# EAGLE design Motherboard_Single (EAGLE 9.6.2)
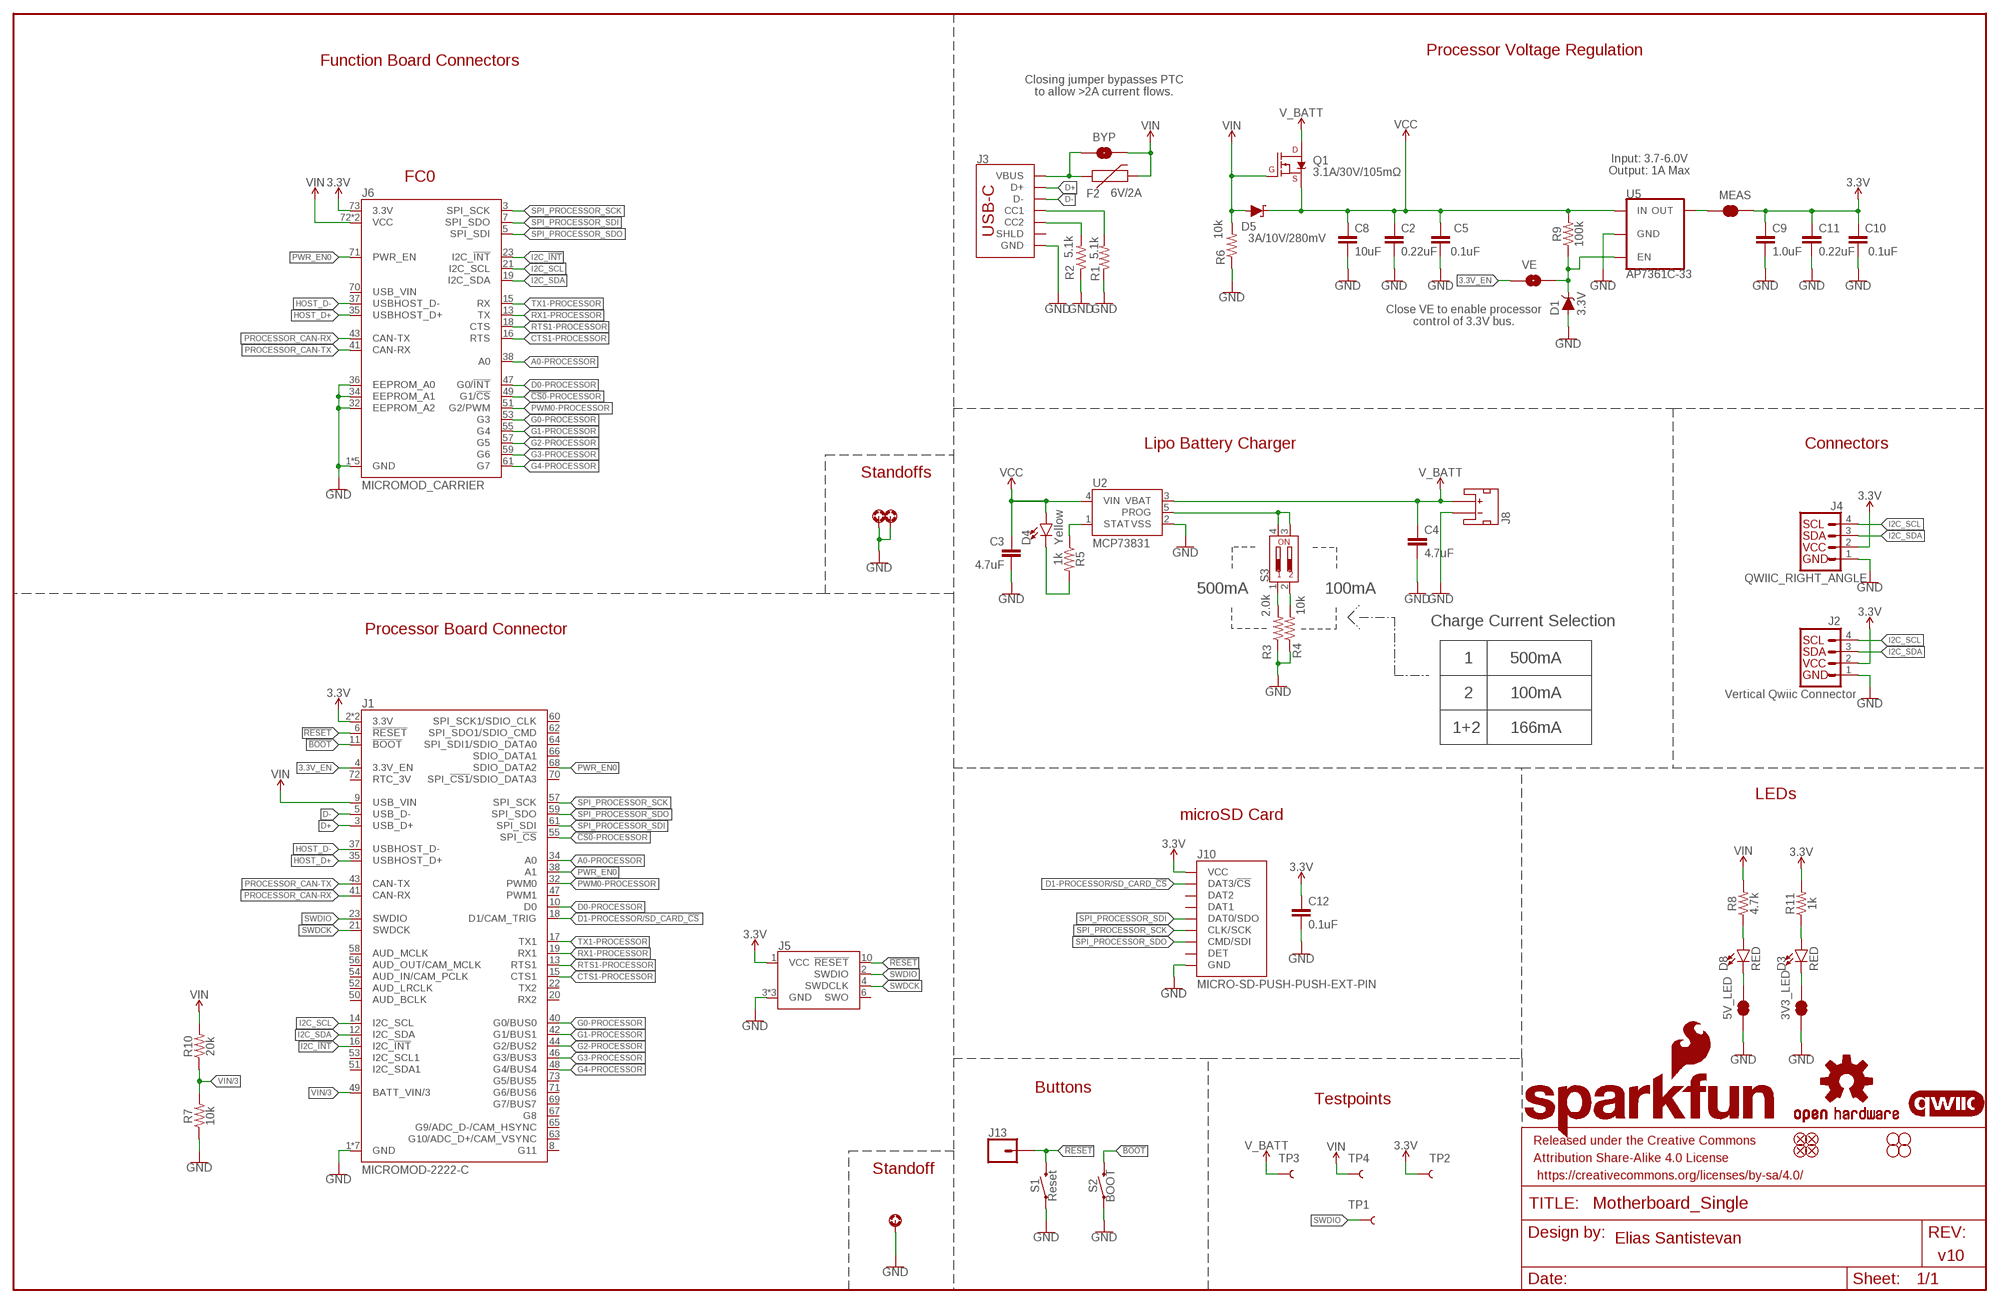
[diagram p0: schematic, sheet 1]

## Parts
3V3_LED  JUMPER-SMT_2_NC_TRACE_SILK  [SMT-JUMPER_2_NC_TRACE_SILK]
5V_LED  JUMPER-SMT_2_NC_TRACE_SILK  [SMT-JUMPER_2_NC_TRACE_SILK]
BYP  JUMPER-SMT_2_NO_SILK  [SMT-JUMPER_2_NO_SILK]
C2  0.22uF  0.22UF-0603-25V-10%  [0603]
C3  4.7uF  4.7UF-0603-6.3V-(10%)  [0603]
C4  4.7uF  4.7UF-0603-35V-(20%)  [0603]
C5  0.1uF  0.1UF-0603-25V-(+80/-20%)  [0603]
C8  10uF  10UF-0805-10V-10%  [0805]
C9  1.0uF  1.0UF-0603-16V-10%  [0603]
C10  0.1uF  0.1UF-0603-25V-(+80/-20%)  [0603]
C11  0.22uF  0.22UF-0603-25V-10%  [0603]
C12  0.1uF  0.1UF-0603-25V-(+80/-20%)  [0603]
D1  3.3V  DIODE-ZENER-MM3Z3V3T1G  [SOD-323]
D3  RED  LED-RED0603  [LED-0603]
D4  Yellow  LED-YELLOW0603  [LED-0603]
D5  3A/10V/280mV  DIODE-SCHOTTKY-BAT60A  [SOD-323]
D8  RED  LED-RED0603  [LED-0603]
F2  6V/2A  PPTC_6V2A  [1210]
FD1  FIDUCIAL1X2  [FIDUCIAL-1X2]
FD2  FIDUCIAL1X2  [FIDUCIAL-1X2]
FD3  FIDUCIAL1X2  [FIDUCIAL-1X2]
FD4  FIDUCIAL1X2  [FIDUCIAL-1X2]
FRAME1  FRAME-LEDGER  [CREATIVE_COMMONS]
H3  STAND-OFF-REFLOW-M2.5_2.5MM_TALL  [STAND-OFF-REFLOW-M2.5]
H4  STAND-OFF-REFLOW-M2.5_2.5MM_TALL  [STAND-OFF-REFLOW-M2.5]
H8  STAND-OFF-REFLOW-M2.5_2.5MM_TALL  [STAND-OFF-REFLOW-M2.5]
H14  STAND-OFFTIGHT  [STAND-OFF-TIGHT]
H15  STAND-OFFTIGHT  [STAND-OFF-TIGHT]
H16  STAND-OFFTIGHT  [STAND-OFF-TIGHT]
H17  STAND-OFFTIGHT  [STAND-OFF-TIGHT]
J1  MICROMOD-2222-C  [M.2-CONNECTOR-E]
J2  Vertical Qwiic Connector  QWIIC_CONNECTOR  [JST04_1MM_VERT]
J3  USB_C_2-LAYER_PADS  [USB-C-16P-2LAYER-PADS]
J4  QWIIC_RIGHT_ANGLE  QWIIC_CONNECTORJS-1MM  [JST04_1MM_RA]
J5  CORTEX_JTAG_DEBUG_MINIMUM_PTH  [2X5-PTH-1.27MM]
J6  MICROMOD_CARRIER  [M.2-CONNECTOR-E-FUNCTION-STANDARD]
J8  JST_2MM_MALE  [JST-2-SMD]
J10  MICRO-SD-PUSH-PUSH-EXT-PIN  [MICROSD-EXTERNALPIN]
J13  CONN_01PTH_NO_SILK_YES_STOP  [1X01_NO_SILK]
LOGO1  QWIIC_LOGO_8MM  [QWIIC_8MM]
LOGO2  SFE_LOGO_NAME_FLAME.3_INCH  [SFE_LOGO_NAME_FLAME_.3]
LOGO3  OSHW-LOGOL  [OSHW-LOGO-L]
MEAS  JUMPER-COMBO_2_NC_TRACE  [COMBO-JUMPER_2_NC_TRACE]
Q1  3.1A/30V/105mΩ  MOSFET_PCH-DMG2307L  [SOT23-3]
R1  5.1k  5.1KOHM5.1KOHM-0603-1/10W-1%  [0603]
R2  5.1k  5.1KOHM5.1KOHM-0603-1/10W-1%  [0603]
R3  2.0k  2.0KOHM-0603-1/10W-5%  [0603]
R4  10k  10KOHM-0603-1/10W-1%  [0603]
R5  1k  1KOHM-0603-1/10W-1%  [0603]
R6  10k  10KOHM-0603-1/10W-1%  [0603]
R7  10k  10KOHM-0603-1/10W-1%  [0603]
R8  4.7k  4.7KOHM-0603-1/10W-1%  [0603]
R9  100k  100KOHM-0603-1/10W-1%  [0603]
R10  20k  20KOHM-0603-1/10W-1%  [0603]
R11  1k  1KOHM-0603-1/10W-1%  [0603]
S1  Reset  MOMENTARY-SWITCH-SPST-SMD-5.2-TALL-REDUNDANT  [TACTILE_SWITCH_SMD_5.2MM]
S2  BOOT  MOMENTARY-SWITCH-SPST-SMD-5.2-TALL-REDUNDANT  [TACTILE_SWITCH_SMD_5.2MM]
S3  DIP-02-SMD-50MIL  [DIPSWITCH-02-50MIL]
TP1  TEST-POINT3X5  [PAD.03X.05]
TP2  TEST-POINT3X5  [PAD.03X.05]
TP3  TEST-POINT3X5  [PAD.03X.05]
TP4  TEST-POINT3X5  [PAD.03X.05]
U2  MCP73831  [SOT23-5]
U5  AP7361C-33  AP7361C-33FGEUDFN-8  [UDFN-8]
VE  JUMPER-SMT_2_NO_SILK  [SMT-JUMPER_2_NO_SILK]

## Nets
3.3V [POWER]: C9.1 C10.1 C11.1 C12.1 J1.2(3.3V) J1.74(3.3V) J2.2 J4.2 J5.1(VCC) J6.73(3.3V) J10.4(VCC) MEAS.2 MEAS.4 R11.2 TP2.1
3.3V_EN: J1.4(3.3V_EN) VE.1
3.3V_EN_VE: D1.C R9.1 U5.5(EN) VE.2
!BOOT!: J1.11(!BOOT!) S2.3 S2.4
!CS0!-PROCESSOR: J1.55(SPI_!CS!) J6.49(G1/!CS!)
!RESET!: J1.6(!RESET!) J5.10(!RESET) J13.1 S1.3 S1.4
A0-PROCESSOR: J1.34(A0) J6.38(A0)
CTS1-PROCESSOR: J1.15(CTS1) J6.16(RTS)
D0-PROCESSOR: J1.10(D0) J6.47(G0/!INT!)
D1-PROCESSOR/SD_CARD_!CS!: J1.18(D1/CAM_TRIG) J10.2(DAT3/!CS!)
D+ [Diff pairs]: J1.3(USB_D+) J3.A6(D+) J3.B6(D+)
D- [Diff pairs]: J1.5(USB_D-) J3.A7(D-) J3.B7(D-)
G0-PROCESSOR: J1.40(G0/BUS0) J6.53(G3)
G1-PROCESSOR: J1.42(G1/BUS1) J6.55(G4)
G2-PROCESSOR: J1.44(G2/BUS2) J6.57(G5)
G3-PROCESSOR: J1.46(G3/BUS3) J6.59(G6)
G4-PROCESSOR: J1.48(G4/BUS4) J6.61(G7)
GND: 3V3_LED.1 5V_LED.1 C2.2 C3.2 C4.2 C5.2 C8.2 C9.2 C10.2 C11.2 C12.2 D1.A H3.1 H4.1 H8.1 J1.1(GND) J1.7(GND) J1.33(GND) J1.36(GND) J1.39(GND) J1.45(GND) J1.75(GND) J2.1 J3.GND J3.GND2(GND) J4.1 J5.3(GND) J5.5(GND) J5.9(GND) J6.1(GND) J6.32(EEPROM_A2) J6.33(GND) J6.34(EEPROM_A1) J6.36(EEPROM_A0) J6.39(GND) J6.45(GND) J6.75(GND) J8.1(-) J10.6(GND) J10.10(GND) J10.11(GND) J10.12(GND) J10.13(GND) R1.1 R2.1 R3.1 R4.1 R6.1 R7.1 S1.1 S1.2 S2.1 S2.2 U2.2(VSS) U5.4(GND) U5.EP(GND)
HOST_D+ [Diff pairs]: J1.35(USBHOST_D+) J6.35(USBHOST_D+)
HOST_D- [Diff pairs]: J1.37(USBHOST_D-) J6.37(USBHOST_D-)
I2C_!INT!: J1.16(I2C_!INT!) J6.23(I2C_!INT!)
I2C_SCL: J1.14(I2C_SCL) J2.4 J4.4 J6.21(I2C_SCL)
I2C_SDA: J1.12(I2C_SDA) J2.3 J4.3 J6.19(I2C_SDA)
N$2: MEAS.1 MEAS.3 U5.1(OUT)
N$3: D3.A R11.1
N$4: J3.B5(CC2) R2.2
N$5: J3.A5(CC1) R1.2
N$6 [POWER]: BYP.1 F2.1 J3.VBUS1(VBUS) J3.VBUS2(VBUS)
N$7: R3.2 S3.1
N$8: S3.3 S3.4 U2.5(PROG)
N$9: 5V_LED.2 D8.C
N$10: 3V3_LED.2 D3.C
N$11: R4.2 S3.2
N$12: D8.A R8.1
N$14: D4.C R5.2
N$15: R5.1 U2.1(STAT)
PROCESSOR_CAN-RX: J1.41(CAN-RX) J6.43(CAN-TX)
PROCESSOR_CAN-TX: J1.43(CAN-TX) J6.41(CAN-RX)
PWM0-PROCESSOR: J1.32(PWM0) J6.51(G2/PWM)
PWR_EN0: J1.38(A1) J1.68(SDIO_DATA2) J6.71(PWR_EN)
RTS1-PROCESSOR: J1.13(RTS1) J6.18(CTS)
RX1-PROCESSOR: J1.19(RX1) J6.13(TX)
SPI_PROCESSOR_SCK: J1.57(SPI_SCK) J6.3(SPI_SCK) J10.5(CLK/SCK)
SPI_PROCESSOR_SDI: J1.61(SPI_SDI) J6.7(SPI_SDO) J10.7(DAT0/SDO)
SPI_PROCESSOR_SDO: J1.59(SPI_SDO) J6.5(SPI_SDI) J10.3(CMD/SDI)
SWDCK: J1.21(SWDCK) J5.4(SWDCLK)
SWDIO: J1.23(SWDIO) J5.2(SWDIO) TP1.1
TX1-PROCESSOR: J1.17(TX1) J6.15(RX)
V_BATT [POWER]: C4.1 J8.2(+) Q1.3(D) TP3.1 U2.3(VBAT)
VCC: C2.1 C3.1 C5.1 C8.1 D4.A D5.C Q1.2(S) R9.2 U2.4(VIN) U5.8(IN)
VIN: BYP.2 D5.A F2.2 J1.9(USB_VIN) J6.72(VCC) J6.74(VCC) Q1.1(G) R6.2 R8.2 R10.2 TP4.1
VIN/3: J1.49(BATT_VIN/3) R7.2 R10.1
Unconnected: J1.8(G11) J1.20(RX2) J1.22(TX2) J1.47(PWM1) J1.50(AUD_BCLK) J1.51(I2C_SDA1) J1.52(AUD_LRCLK) J1.53(I2C_SCL1) J1.54(AUD_IN/CAM_PCLK) J1.56(AUD_OUT/CAM_MCLK) J1.58(AUD_MCLK) J1.60(SPI_SCK1/SDIO_CLK) J1.62(SPI_SDO1/SDIO_CMD) J1.63(G10/ADC_D+/CAM_VSYNC) J1.64(SPI_SDI1/SDIO_DATA0) J1.65(G9/ADC_D-/CAM_HSYNC) J1.66(SDIO_DATA1) J1.67(G8) J1.69(G7/BUS7) J1.70(SPI_!CS1!/SDIO_DATA3) J1.71(G6/BUS6) J1.72(RTC_3V) J1.73(G5/BUS5) J3.SHLD1(SHLD) J3.SHLD2(SHLD) J3.SHLD3(SHLD) J3.SHLD4(SHLD) J5.6(SWO) J6.70(USB_VIN) J8.NC1(PAD1) J8.NC2(PAD2) J10.1(DAT2) J10.8(DAT1) J10.9(DET)

## Notes on the sheet
- Processor Voltage Regulation
- Function Board Connectors
- Closing jumper bypasses PTC
  to allow >2A current flows.
- Input: 3.7-6.0V
  Output: 1A Max
- FC0
- Close VE to enable processor
  control of 3.3V bus.
- Lipo Battery Charger | Connectors
- Standoffs
- 500mA | 100mA
- Charge Current Selection
- Processor Board Connector
- 1 | 500mA
- 2 | 100mA
- 1+2 | 166mA
- LEDs
- microSD Card
- Buttons
- Testpoints
- Standoff
- Elias Santistevan
- v10

## Library data of the parts
3V3_LED 5V_LED = SparkFun-Jumpers:JUMPER-SMT_2_NC_TRACE: Normally closed trace jumper This jumper has a trace between two pads so it's normally closed (NC). Use a razor knife to open the connection. For best results follow the IPC guidelines for cutting traces: Cutout at least 0.063 mm (0.005 in). Remove all loose material to clean up the cut area. Seal the cut with an approved epoxy. Reapply solder to reclose the connection.
BYP VE = SparkFun-Jumpers:JUMPER-SMT_2_NO: Normally open jumper This jumper has two pads in close proximity to each other. Apply solder to close the connection. Round pads are easier to solder for beginners, but are a lot larger. SparkFun Product that uses the round pads: SparkFun EL Sequencer <https://www.sparkfun.com/products/12781>
C2 C11 = SparkFun-Capacitors:0.22UF: 0.22µF ceramic capacitors A capacitor is a passive two-terminal electrical component used to store electrical energy temporarily in an electric field.; PROD_ID: CAP-07822
C3 = SparkFun-Capacitors:4.7UF: 4.7µF ceramic capacitors A capacitor is a passive two-terminal electrical component used to store electrical energy temporarily in an electric field.; PROD_ID: CAP-08280
C4 = SparkFun-Capacitors:4.7UF: 4.7µF ceramic capacitors A capacitor is a passive two-terminal electrical component used to store electrical energy temporarily in an electric field.; PROD_ID: CAP-14106
C5 C10 C12 = SparkFun-Capacitors:0.1UF: 0.1µF ceramic capacitors A capacitor is a passive two-terminal electrical component used to store electrical energy temporarily in an electric field.; PROD_ID: CAP-00810
C8 = SparkFun-Capacitors:10UF: 10.0µF ceramic capacitors A capacitor is a passive two-terminal electrical component used to store electrical energy temporarily in an electric field.; PROD_ID: CAP-11330
C9 = SparkFun-Capacitors:1.0UF: 1µF ceramic capacitors A capacitor is a passive two-terminal electrical component used to store electrical energy temporarily in an electric field.; PROD_ID: CAP-00868
D1 = SparkFun-DiscreteSemi:DIODE-ZENER: Zener Diode A Zener diode allows current to flow from its anode to its cathode like a normal semiconductor diode, but it also permits current to flow in the reverse direction when its "Zener voltage" is reached. - WIkipedia; PROD_ID: DIO-11284
D3 D8 = SparkFun-LED:LED-RED: Red SMD LED Used in manufacturing of most products at SparkFun Packages: 0603 - SMD 0603 package [Product Link] <http://docs.avagotech.com/docs/AV02-0551EN> 0603 SMART - SMD 0603 SMART package ( more efficient and expensive)[Product Link] <http://www.osram-os.com/Graphics/XPic2/00077099_0.pdf> 1206 - SMD1206 package [Product Link] <https://www.sparkfun.com/datasheets/DevTools/LilyPad/Q150OVS4.pdff> SparkFun Products: Pro Mini 328 -5V <https://www.sparkfun.com/products/821> RedBoard <https://www.sparkfun.com/products/12757> IOIO-OTG <https://www.sparkfun.com/products/13613>; PROD_ID: DIO-00819
D4 = SparkFun-LED:LED-YELLOW: Yellow SMD LED Used in manufacturing several products at SparkFun. Packages: 0603 - SMD 0603 package[Product Link] <http://www.kingbrightusa.com/product.asp?catalog_name=LED&product_id=APT1608SYCK> 0603 -SMART - SMART SMD 0603 package (more efficient/more expensive) [Product Link] <http://www.osram-os.com/osram_os/en/products/product-catalog/led-light-emitting-diodes/smartled-0603/ly-l29k/index.jsp> LilyPad - SMD1206 package[Product Datasheet] <https://www.sparkfun.com/datasheets/DevTools/LilyPad/Q150YUS4.pdf> SparkFun Products: Blynk Board <https://www.sparkfun.com/products/13794> IOIO-OTG <https://www.sparkfun.com/products/13613> XBee Explorer Serial <https://www.sparkfun.com/products/13225>; PROD_ID: DIO-09003
D5 = SparkFun-DiscreteSemi:DIODE-SCHOTTKY: Schottky diode A Schottky diode is a semiconductor diode which has a low forward voltage drop and a very fast switching action.; PROD_ID: DIO-14072
F2 = SparkFun-Fuses:PPTC: Resettable Fuse PPTC Resettable Fuse. Really a sort of resistor with a polymeric positive temperature coefficient whose resistance increases dramatically with an increase in temperature. When heated by the power passing through the resistance rises causing the current to be limited, protecting the circuit. This is achieved by the transition of the polymer from a crystalline to an amorphous state where the conductive carbon separates breaking the conductive pathways found in the cool crystalline structure. When a PPTC cools back down it resumes conducting letting the circuit turn back on. SparkFun Products: SparkFun RedBoard - Programmed with Arduino <https://www.sparkfun.com/products/12757> Pro Micro - 5V/16MHz <https://www.sparkfun.com/products/12640> Arduino Pro 328 - 5V/16MHz <https://www.sparkfun.com/products/10915> MP3 Trigger <https://www.sparkfun.com/products/13720>; PROD_ID: RES-14313
FD1-FD4 = SparkFun-Aesthetics:FIDUCIAL: Fiducial Alignment Points Point-of-reference for pick-and-place machines and other optical instruments.
FRAME1 = SparkFun-Aesthetics:FRAME-LEDGER: Schematic Frame - Ledger Standard 11x14 US Ledger frame
H3 H4 H8 = SparkFun-Hardware:STAND-OFF-REFLOW: Stand Off Reflow Compatible A metal standoff that can be placed and reflowed onto a PCB. The M2.5 x 2.5mm variant is used on MicroMod. The M2.0 x 6.0mm variant is used to mount the Iridium 9603N modem.; PROD_ID: HW-14899
H14-H17 = SparkFun-Hardware:STAND-OFF: Stand Off Drill holes for mechanically mounting via screws, standoffs, etc. Note: Use the keepout ring to avoid running the screw head into surrounding components. Variant Overviews STAND-OFF - Mechanical footprint for a #4 phillips button head screw. STAND-OFF-TIGHT - Mechanical footprint for a #4 phillips button head screw, Example SparkFun Products Screw - Phillips Head (1/4", 4-40, 10 pack) <https://www.sparkfun.com/products/10453> (PRT-10453) Screw - Phillips Head (1/2", 4-40, 10 pack) <https://www.sparkfun.com/products/10452> (PRT-10452) Screw - Phillips Head (3/4", 4-40, 10 pack) <https://www.sparkfun.com/products/10451> (PRT-10451) Screw - Phillips Head (1", 4-40, 10 pack) <https://www.sparkfun.com/products/10450> (PRT-10450)
J1 = SparkFun-MicroMod:MICROMOD: MicroMod Connector Description: A card edge connector and mating PCB connector to allow various MicroMod Processor Boards to be coupled with various carrier boards of different capabilities. Based on the M.2 standard.; PROD_ID: CONN-14877
J2 = SparkFun-Connectors:QWIIC_CONNECTOR: SparkFun I2C Standard Qwiic Connector An SMD 1mm pitch JST connector makes it easy and quick (get it? Qwiic?) to connect I2C devices to each other. The Qwiic system <http://www.sparkfun.com/qwiic> enables fast and solderless connection between popular platforms and various sensors and actuators. We carry 200mm <https://www.sparkfun.com/products/14204>, 100mm <https://www.sparkfun.com/products/14205>, 50mm <https://www.sparkfun.com/products/14206>, and breadboard friendly <https://www.sparkfun.com/products/14207> Qwiic cables. We also offer 10 pcs strips <https://www.sparkfun.com/products/14323> the SMD connectors.; PROD_ID: CONN-14483
J3 = SparkFun-Connectors:USB_C: USB Type C 16Pin Connector Super Speed pins not available on the 16-pin purely SMD connector so this part is best for USB 2.0 implementations. D1 and D2 are tied together enabling D+/- no matter which way the cable is plugged into the connector. The two channel configuration pins (CC1/2) are exposed. These are normally connected to ground via 5.1k resistors but can be reconfigured for high current/high power applications. **4-LAYER BOARD WARNING!!** If designing 4-layer board, make sure to select the variant _4-LAYER-ISOLATED. The linked footprint (USB-C-16-4LAYER-ISOLATED) includes some very necessary cutout polygons in the inner layers (2 and 15). This prevents the PTH mounting shield legs on the USB connector from electrically connecting any other polygons on the inner layers (usually VCC and GND).; PROD_ID: CONN-14122
J4 = SparkFun-Connectors:QWIIC_CONNECTOR: SparkFun I2C Standard Qwiic Connector An SMD 1mm pitch JST connector makes it easy and quick (get it? Qwiic?) to connect I2C devices to each other. The Qwiic system <http://www.sparkfun.com/qwiic> enables fast and solderless connection between popular platforms and various sensors and actuators. We carry 200mm <https://www.sparkfun.com/products/14204>, 100mm <https://www.sparkfun.com/products/14205>, 50mm <https://www.sparkfun.com/products/14206>, and breadboard friendly <https://www.sparkfun.com/products/14207> Qwiic cables. We also offer 10 pcs strips <https://www.sparkfun.com/products/14323> the SMD connectors.; PROD_ID: CONN-13694
J5 = SparkFun-Connectors:CORTEX_JTAG_DEBUG_MINIMUM: Cortex Debug Connector - 10 pin Supports JTAG debug, Serial Wire debug, and Serial Wire Viewer. PTH and SMD connector options available. General Connector Information <http://infocenter.arm.com/help/topic/com.arm.doc.faqs/attached/13634/cortex_debug_connectors.pdf> Products: PTH Connector <http://www.digikey.com/product-detail/en/cnc-tech/3220-10-0100-00/1175-1627-ND/3883661> -via Digi-Key SparkFun PSoc <https://www.sparkfun.com/products/13229> SparkFun T <https://www.sparkfun.com/products/13810>
J6 = SparkFun-MicroMod-Function:MICROMOD: MicroMod Connector Description: A card edge connector and mating PCB connector to allow various MicroMod Processor Boards to be coupled with various carrier boards of different capabilities. Based on the M.2 standard.; PROD_ID: CONN-14877
J8 = SparkFun-Connectors:JST_2MM_MALE: JST 2MM MALE RA CONNECTOR Two pin, compact surface mount connector. Commonly used as a battery input connection point. We really like the solid locking feeling and high current rating on these small connectors. We use these all the time as battery connectors. Mates to single-cell LiPo batteries. Here is the connector we sell at SparkFun: JST Right Angle Connector - White <https://www.sparkfun.com/products/8612> (PRT-08612) Datasheet <http://www.sparkfun.com/datasheets/Prototyping/Connectors/JST-Horizontal.pdf> It was used on these SparkFun products: SparkFun MOSFET Power Controller <https://www.sparkfun.com/products/11214> (PRT-11214) SparkFun Battery Babysitter - LiPo Battery Manager <https://www.sparkfun.com/products/13777> (PRT-13777) And many, many others that required a lipo battery connection.; PROD_ID: CONN-11443; SF_ID: PRT-08612
J10 = SparkFun-Connectors:MICRO-SD: microSD Socket for Transflash Various sockets for µSD. tDoc lines correctly indicate media card edge positions when inserting (unlocked, locked, depressed). NOTE: CD1 and CD2 are connected internally, and the default detect state of the socket is detect pin to ground. SparkFun Products: WAV Trigger <https://www.sparkfun.com/products/13660> CAN-Bus Shield <https://www.sparkfun.com/products/13262> SparkFun Level Shifing microSD Breakout <https://www.sparkfun.com/products/13743>; PROD_ID: CONN-16110
J13 = SparkFun-Connectors:CONN_01: Single connection point. Often used as Generic Header-pin footprint for 0.1 inch spaced/style header connections On any of the 0.1 inch spaced packages, you can populate with these: Break Away Headers - Straight <https://www.sparkfun.com/products/116> (PRT-00116) Break Away Male Headers - Right Angle <https://www.sparkfun.com/products/553> (PRT-00553) Female Headers <https://www.sparkfun.com/products/115> (PRT-00115) Break Away Headers - Machine Pin <https://www.sparkfun.com/products/117> (PRT-00117) Break Away Female Headers - Swiss Machine Pin <https://www.sparkfun.com/products/743> (PRT-00743) This device is also useful as a general connection point to wire up your design to another part of your project. Our various solder wires solder well into these plated through hole pads. Hook-Up Wire - Assortment (Stranded, 22 AWG) <https://www.sparkfun.com/products/11375> (PRT-11375) Hook-Up Wire - Assortment (Solid Core, 22 AWG) <https://www.sparkfun.com/products/11367> (PRT-11367) View the entire wire category on our website here <https://www.sparkfun.com/categories/141> Special notes: SMTSO-256-ET is a "flush mount" nut for a 4-40 screw. We mostly use this on specialty testbeds; it is a nice way to connect hardware to your PCB at an adjustable hieght. Also note, the SNAP packages are for using a snappable style connector. We sell a baggie of snaps and they are also used on two LilyPad designs: Snap Assortment - 30 pack (male and female) <https://www.sparkfun.com/products/11347> (DEV-11347) LilyPad Arduino SimpleSnap <https://www.sparkfun.com/products/10941> (DEV-10941) LilyPad SimpleSnap Protoboard <https://www.sparkfun.com/products/10940> (DEV-10940)
LOGO1 = SparkFun-Aesthetics:QWIIC_LOGO: Qwiic Logos for placement on schematic and PCB. The 5.5mm silk logo is best for placing next to Qwiic connector.
LOGO2 = SparkFun-Aesthetics:SFE_LOGO_NAME_FLAME: SparkFun Font Logo w/ Flame This is the SparkFun full logo. The logo on the schematic will always be the same size; the package variant is the height of the flame part of the logo. Default layer for the logo on the board is tSilk.
LOGO3 = SparkFun-Aesthetics:OSHW-LOGO: Open-Source Hardware (OSHW) Logo This logo indicates the piece of hardware it is found on incorporates a OSHW license and/or adheres to the definition of open source hardware found here: http://freedomdefined.org/OSHW
MEAS = SparkFun-Jumpers:JUMPER-COMBO_2_NC_TRACE
Q1 = SparkFun-DiscreteSemi:MOSFET_PCH: P-channel MOSFETs Voltage controlled devices that allow control of high current outputs. SparkFun Products: SparkFun ESP32 Thing <https://www.sparkfun.com/products/13907> SparkFun ESP8266 Thing <https://www.sparkfun.com/products/13231> SparkFun Pi Servo HAT V2 <https://www.sparkfun.com/products/15316> DMG2305UX-7 (20V/4.2A/SOT23-3); PROD_ID: TRANS-11308
R1 R2 = SparkFun-Resistors:5.1KOHM; PROD_ID: RES-12083
R3 = SparkFun-Resistors:2.0KOHM: 2kΩ resistor A resistor is a passive two-terminal electrical component that implements electrical resistance as a circuit element. Resistors act to reduce current flow, and, at the same time, act to lower voltage levels within circuits. - Wikipedia; PROD_ID: RES-08296
R4 R6 R7 = SparkFun-Resistors:10KOHM: 10kΩ resistor A resistor is a passive two-terminal electrical component that implements electrical resistance as a circuit element. Resistors act to reduce current flow, and, at the same time, act to lower voltage levels within circuits. - Wikipedia; PROD_ID: RES-00824
R5 R11 = SparkFun-Resistors:1KOHM: 1kΩ resistor A resistor is a passive two-terminal electrical component that implements electrical resistance as a circuit element. Resistors act to reduce current flow, and, at the same time, act to lower voltage levels within circuits. - Wikipedia; PROD_ID: RES-07856
R8 = SparkFun-Resistors:4.7KOHM: 4.7kΩ resistor A resistor is a passive two-terminal electrical component that implements electrical resistance as a circuit element. Resistors act to reduce current flow, and, at the same time, act to lower voltage levels within circuits. - Wikipedia; PROD_ID: RES-07857
R9 = SparkFun-Resistors:100KOHM: 100kΩ resistor A resistor is a passive two-terminal electrical component that implements electrical resistance as a circuit element. Resistors act to reduce current flow, and, at the same time, act to lower voltage levels within circuits. - Wikipedia; PROD_ID: RES-07828
R10 = SparkFun-Resistors:20KOHM: 20kΩ resistor A resistor is a passive two-terminal electrical component that implements electrical resistance as a circuit element. Resistors act to reduce current flow, and, at the same time, act to lower voltage levels within circuits. - Wikipedia; PROD_ID: RES-09383
S1 S2 = SparkFun-Switches:MOMENTARY-SWITCH-SPST: Momentary Switch (Pushbutton) - SPST Normally-open (NO) SPST momentary switches (buttons, pushbuttons). Variants PTH-12MM - 12mm square, through-hole Momentary Pushbutton Switch - 12mm Square <https://www.sparkfun.com/products/9190> (COM-09190) PTH-6.0MM, PTH-6.0MM-KIT - 6.0mm square, through-hole Mini Pushbutton Switch <https://www.sparkfun.com/products/97> (COM-00097) KIT package intended for soldering kit's - only one side of pads' copper is exposed. PTH-RIGHT-ANGLE-KIT - Right-angle, through-hole Right Angle Tactile Button <https://www.sparkfun.com/products/10791> - Used on SparkFun BigTime Watch Kit <https://www.sparkfun.com/products/11734> SMD-12MM - 12mm square, surface-mount Tactile Button - SMD (12mm) <https://www.sparkfun.com/products/12993> (COM-12993) Used on SparkFun PicoBoard <https://www.sparkfun.com/products/11888> SMD-4.5MM - 4.5mm Square Trackball Switch Used on SparkFun Blackberry Trackballer Breakout <https://www.sparkfun.com/products/13169> SMD-4.6MMX2.8MM - 4.60mm x 2.80mm, surface mount Used on SparkFun Pro Micro - RP2040 <https://www.sparkfun.com/products/17717> SMD-5.2MM, SMD-5.2-REDUNDANT - 5.2mm square, surface-mount Mini Pushbutton Switch - SMD <https://www.sparkfun.com/products/8720> (COM-08720) Used on Arduino Pro Mini <https://www.sparkfun.com/products/11114> REDUNDANT package connects both switch circuits together SMD-6.0X3.5MM - 6.0 x 3.5mm, surface mount Momentary Reset Switch SMD <https://www.sparkfun.com/products/8229> (COM-08229) SMD-6.2MM-TALL - 6.2mm square, surface mount Tactile Button - SMD (6mm) <https://www.sparkfun.com/products/12992> Used on SparkFun Digital Sandbox <https://www.sparkfun.com/products/12651> SMD-RIGHT-ANGLE - Right-angle, surface mount Used on SparkFun Block for Intel® Edison - Arduino <https://www.sparkfun.com/products/13036>; PROD_ID: SWCH-14139
S3 = SparkFun-Switches:DIP-02: 2-Position DIP Switch 2-circuit DIP (dual inline package) switch. Commonly used to physcially set a circuit's behavior. Variants PTH-100MIL - Through-hole, 0.1"-Pitch Used on SparkFun Stepoko <https://www.sparkfun.com/products/13899> (ROB-13899) SMD-50MIL-JWING - SMD (J-Wing Pads), 0.05"-Pitch Prototype Part SMD-50MIL - SMD, 0.05"-Pitch Used on SparkFun Battery Babysitter <https://www.sparkfun.com/products/13777> (PRT-13777); PROD_ID: SWCH-13215
TP1-TP4 = SparkFun-Connectors:TEST-POINT: SparkFun Test Points Bare copper test points for troubleshooting or In-Circuit-Testing. These are used by our Production team for verifying production board runs using pogo-pins on test beds. SparkFun Products: SparkFun LSM9DS1 Breakout <https://www.sparkfun.com/products/13284> SparkFun PSOC <https://www.sparkfun.com/products/13714> SparkFun Load Cell Amplifier <https://www.sparkfun.com/products/13879>
U2 = SparkFun-IC-Power:MCP73831: MCP73831T Li-Ion, Li-Pol Controller Miniature single cell, fully integrated Li-Ion, Li-polymer charge management controller Datasheet <http://ww1.microchip.com/downloads/en/DeviceDoc/20001984g.pdf> SparkFun Products: SparkFun ESP32 Thing <https://www.sparkfun.com/products/13907> SparkFun 9DoF Razor IMU M0 <https://www.sparkfun.com/products/14001>; PROD_ID: IC-09995
U5 = SparkFun-IC-Power:AP7361C-33FGE: AP7361C 3.3V LDO Regulator; PROD_ID: VREG-14094

## Net classes
0 default: width 0.178 mm, drill 0.305 mm
1 POWER: width 0.559 mm, drill 0.305 mm
2 Diff pairs: width 0.203 mm, drill 0.305 mm

## Board
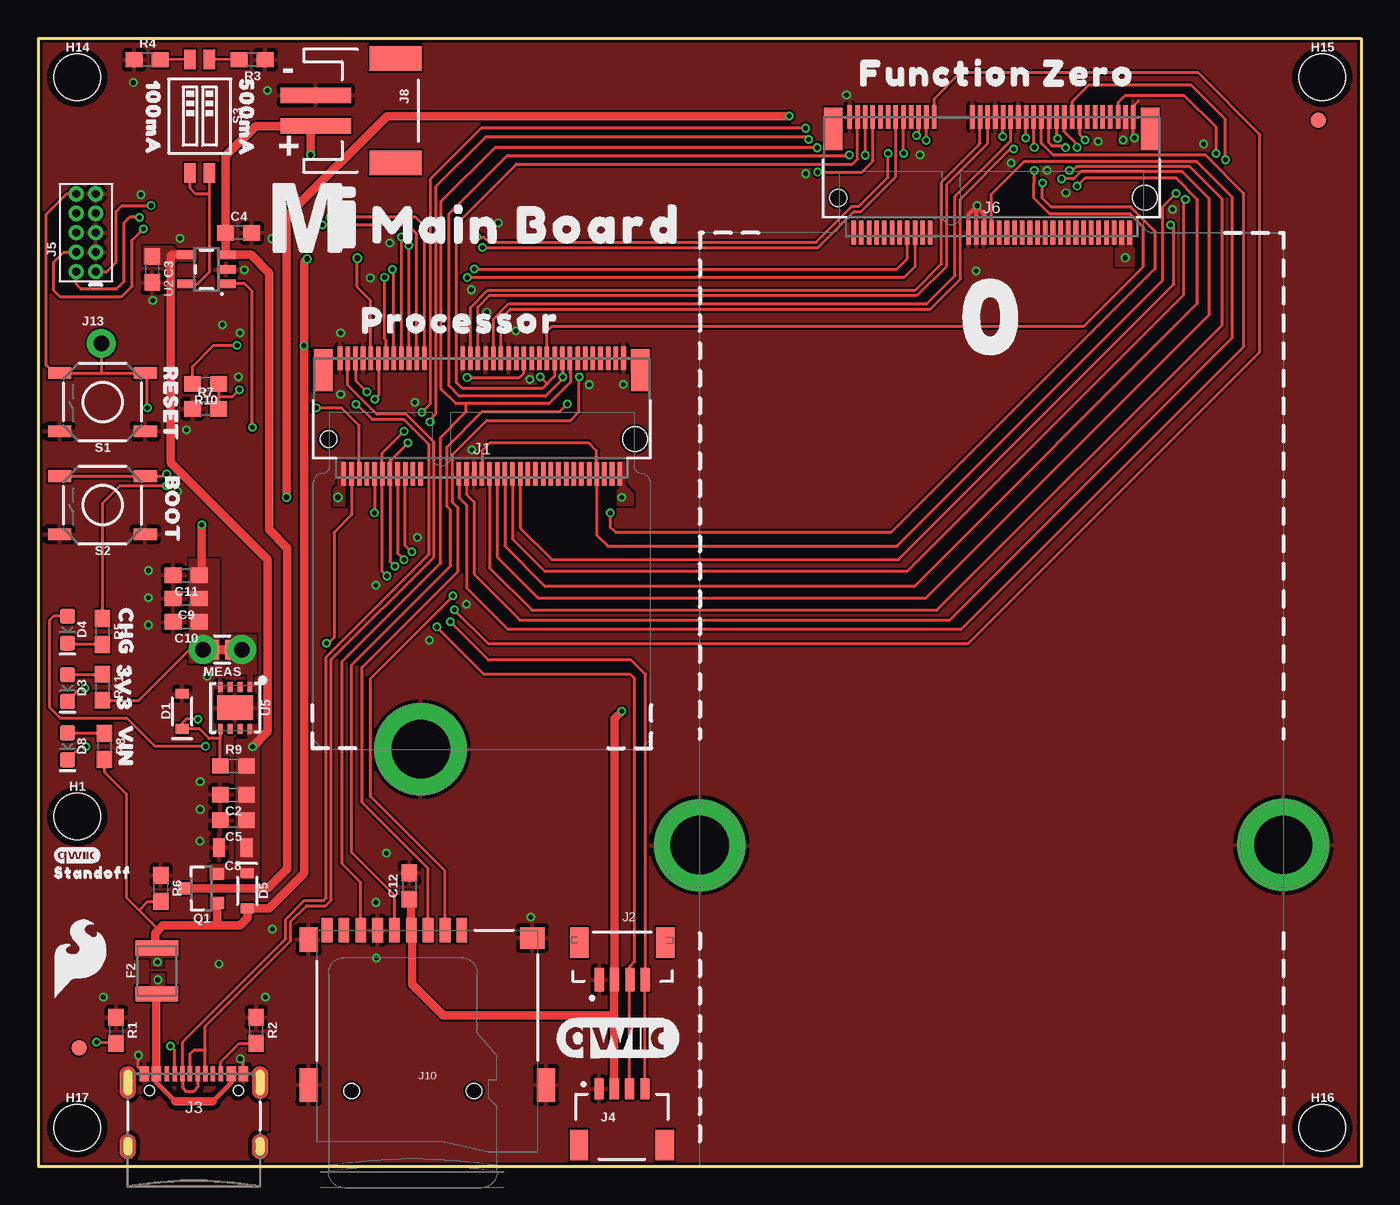
[diagram p1: board, top side]
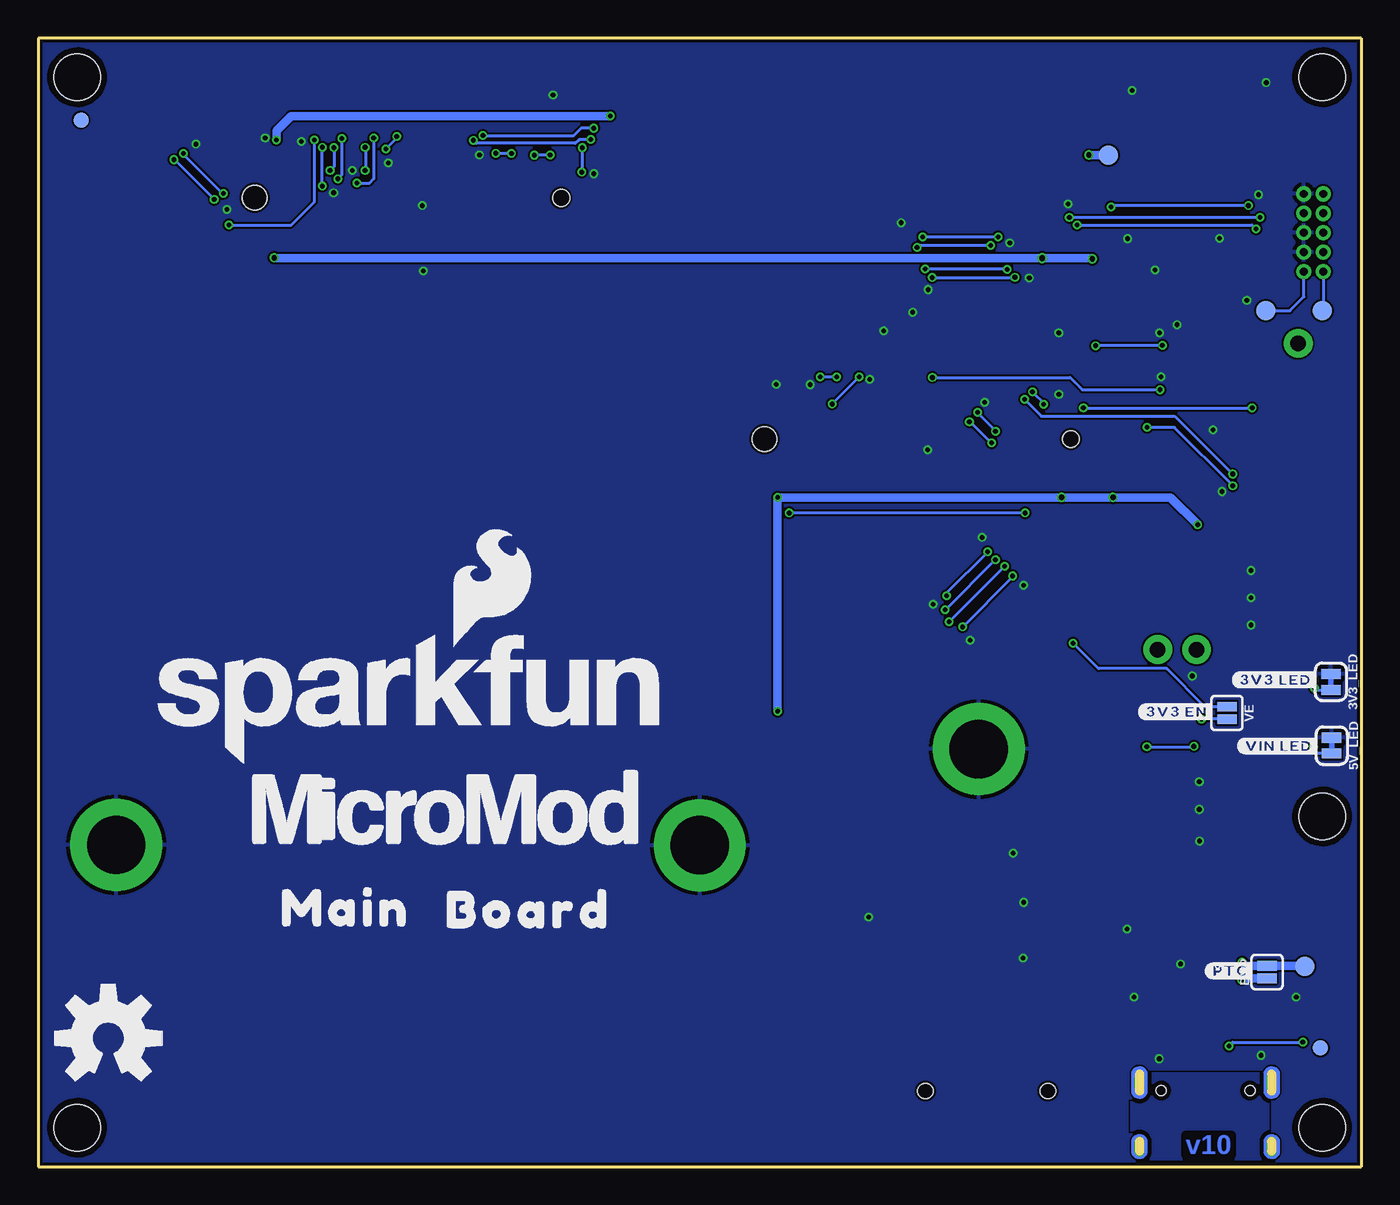
[diagram p2: board, bottom side, seen from below]

Size 86.36 x 73.66 mm. Coordinates in mm from the lower left corner, seen from the top.
Outline: 86.36,0 0,0 0,73.66 86.36,73.66 86.36,0
Copper layers (1*16): Top 0.035mm / dielectric 1.5mm / Bottom 0.035mm
Design rules "SparkFun-2-Layer-Minimum-JLCPCB": minimum track width 5mil, minimum drill 0.3mm, track to track 5mil, track to pad 5mil, pad to pad 5mil, via to via 5mil, smd to smd 5mil, copper to edge 7mil, drill to drill 7mil, minimum pad ring 5mil, minimum via ring 5mil, stop-mask expansion 2.5mil, vias tented up to drill 25mil, thermal gap 10mil
tRestrict: area 60.9,60.7 to 61,61.2; area 61.4,60.7 to 61.5,61.2

### Footprints (pad centres in the part's own frame; a part is rotated, then mirrored left to right if it is on the bottom)
SMT-JUMPER_2_NC_TRACE_SILK = smd 0.66 x 1.27: 1 -0.521,0; 2 0.521,0
SMT-JUMPER_2_NO_SILK = smd 0.635 x 1.27: 1 -0.406,0; 2 0.406,0
0603 = smd 1.1 x 1: 1 -0.85,0; 2 0.85,0
0805 = smd 0.8 x 1.2: 1 -0.9,0; 2 0.9,0
SOD-323 = smd 0.63 x 0.83: A 1.15,0; C -1.15,0
LED-0603 = smd 1 x 1: A -0.877,0; C 0.877,0
1210 = smd 1 x 2.8: 1 -1.5,0; 2 1.5,0
FIDUCIAL-1X2 = smd 1 x 1: 1 0,0
STAND-OFF-TIGHT = hole 3.048: 0,0
STAND-OFF-REFLOW-M2.5 = drill 3.8 pad 6: 1 0,0
M.2-CONNECTOR-E = smd 0.3 x 1.55: 1 9.25,-5.275; 2 9,2.275; 3 8.75,-5.275; 4 8.5,2.275; 5 8.25,-5.275; 6 8,2.275; 7 7.75,-5.275; 8 7.5,2.275; 9 7.25,-5.275; 10 7,2.275; 11 6.75,-5.275; 12 6.5,2.275; 13 6.25,-5.275; 14 6,2.275; 15 5.75,-5.275; 16 5.5,2.275; 17 5.25,-5.275; 18 5,2.275; 19 4.75,-5.275; 20 4.5,2.275; 21 4.25,-5.275; 22 4,2.275; 23 3.75,-5.275; 32 1.5,2.275; 33 1.25,-5.275; 34 1,2.275; 35 0.75,-5.275; 36 0.5,2.275; 37 0.25,-5.275; 38 0,2.275; 39 -0.25,-5.275; 40 -0.5,2.275; 41 -0.75,-5.275; 42 -1,2.275; 43 -1.25,-5.275; 44 -1.5,2.275; 45 -1.75,-5.275; 46 -2,2.275; 47 -2.25,-5.275; 48 -2.5,2.275; 49 -2.75,-5.275; 50 -3,2.275; 51 -3.25,-5.275; 52 -3.5,2.275; 53 -3.75,-5.275; 54 -4,2.275; 55 -4.25,-5.275; 56 -4.5,2.275; 57 -4.75,-5.275; 58 -5,2.275; 59 -5.25,-5.275; 60 -5.5,2.275; 61 -5.75,-5.275; 62 -6,2.275; 63 -6.25,-5.275; 64 -6.5,2.275; 65 -6.75,-5.275; 66 -7,2.275; 67 -7.25,-5.275; 68 -7.5,2.275; 69 -7.75,-5.275; 70 -8,2.275; 71 -8.25,-5.275; 72 -8.5,2.275; 73 -8.75,-5.275; 74 -9,2.275; 75 -9.25,-5.275 | smd 1.2 x 2.75: A1 10.35,-4.5; A2 -10.35,-4.5 | hole 1.1: 10,0 | hole 1.6: -10,0
JST04_1MM_VERT = smd 0.6 x 1.55: 1 -1.478,0.775; 2 -0.478,0.775; 3 0.522,0.775; 4 1.522,0.775 | smd 1.2 x 2: NC1 -2.778,3.2; NC2 2.822,3.2
USB-C-16P-2LAYER-PADS = smd 0.3 x 1: A5 -1.25,-0.34; A6 -0.25,-0.34; A7 0.25,-0.34; A8 1.25,-0.34; B5 1.75,-0.34; B6 0.75,-0.34; B7 -0.75,-0.34; B8 -1.75,-0.34 | smd 0.6 x 1: GND -3.225,-0.34; GND2 3.225,-0.34; VBUS1 -2.45,-0.34; VBUS2 2.45,-0.34 | drill 0.4 pad 0.6 long: SHLD1 -4.318,-0.915; SHLD2 4.318,-0.915; SHLD3 -4.318,-5.095; SHLD4 4.318,-5.095 | hole 0.65: -2.89,-1.445; 2.89,-1.445
JST04_1MM_RA = smd 0.6 x 1.35: 1 -1.5,0; 2 -0.5,0; 3 0.5,0; 4 1.5,0 | smd 1.2 x 2: NC1 2.8,-3.675; NC2 -2.8,-3.675
2X5-PTH-1.27MM = drill 0.508 pad 1: 1 -2.54,-0.635; 2 -2.54,0.635; 3 -1.27,-0.635; 4 -1.27,0.635; 5 0,-0.635; 6 0,0.635; 7 1.27,-0.635; 8 1.27,0.635; 9 2.54,-0.635; 10 2.54,0.635
M.2-CONNECTOR-E-FUNCTION-STANDARD = smd 0.3 x 1.55: 1 9.25,-5.275; 2 9,2.275; 3 8.75,-5.275; 4 8.5,2.275; 5 8.25,-5.275; 6 8,2.275; 7 7.75,-5.275; 8 7.5,2.275; 9 7.25,-5.275; 10 7,2.275; 11 6.75,-5.275; 12 6.5,2.275; 13 6.25,-5.275; 14 6,2.275; 15 5.75,-5.275; 16 5.5,2.275; 17 5.25,-5.275; 18 5,2.275; 19 4.75,-5.275; 20 4.5,2.275; 21 4.25,-5.275; 22 4,2.275; 23 3.75,-5.275; 32 1.5,2.275; 33 1.25,-5.275; 34 1,2.275; 35 0.75,-5.275; 36 0.5,2.275; 37 0.25,-5.275; 38 0,2.275; 39 -0.25,-5.275; 40 -0.5,2.275; 41 -0.75,-5.275; 42 -1,2.275; 43 -1.25,-5.275; 44 -1.5,2.275; 45 -1.75,-5.275; 46 -2,2.275; 47 -2.25,-5.275; 48 -2.5,2.275; 49 -2.75,-5.275; 50 -3,2.275; 51 -3.25,-5.275; 52 -3.5,2.275; 53 -3.75,-5.275; 54 -4,2.275; 55 -4.25,-5.275; 56 -4.5,2.275; 57 -4.75,-5.275; 58 -5,2.275; 59 -5.25,-5.275; 60 -5.5,2.275; 61 -5.75,-5.275; 62 -6,2.275; 63 -6.25,-5.275; 64 -6.5,2.275; 65 -6.75,-5.275; 66 -7,2.275; 67 -7.25,-5.275; 68 -7.5,2.275; 69 -7.75,-5.275; 70 -8,2.275; 71 -8.25,-5.275; 72 -8.5,2.275; 73 -8.75,-5.275; 74 -9,2.275; 75 -9.25,-5.275 | smd 1.2 x 2.75: A1 10.35,-4.5; A2 -10.35,-4.5 | hole 1.1: 10,0 | hole 1.6: -10,0
JST-2-SMD = smd 1 x 4.6: 1 -1,-3.7; 2 1,-3.7 | smd 1.6 x 3.4: NC1 -3.4,1.5; NC2 3.4,1.5
MICROSD-EXTERNALPIN = smd 0.7 x 1.6: 1 2.25,10.5; 2 1.15,10.5; 3 0.05,10.5; 4 -1.05,10.5; 5 -2.15,10.5; 6 -3.25,10.5; 7 -4.35,10.5; 8 -5.45,10.5; 9 -6.55,10.5 | smd 1.2 x 1.6: 10 -7.75,9.9 | smd 1.2 x 2.2: 11 -7.75,0.4; 12 7.75,0.4 | smd 1.6 x 1.4: 13 6.85,10 | hole 1: 3.05,0; -4.95,0
1X01_NO_SILK = drill 1.016 pad 1.88: 1 0,0
COMBO-JUMPER_2_NC_TRACE = smd 0.635 x 1.27: 1 -0.508,0; 2 0.508,0 | drill 1.016 pad 1.88: 3 -1.27,0; 4 1.27,0
SOT23-3 = smd 0.8 x 0.9: 1 -0.95,-1; 2 0.95,-1; 3 0,1.1
TACTILE_SWITCH_SMD_5.2MM = smd 1.524 x 0.762: 1 -2.794,1.905; 2 2.794,1.905; 3 -2.794,-1.905; 4 2.794,-1.905
DIPSWITCH-02-50MIL = smd 0.762 x 1.27: 1 -0.635,-3.7; 2 0.635,-3.7; 3 0.635,3.7; 4 -0.635,3.7
PAD.03X.05 = smd 1.27 x 1.27: 1 0,0
SOT23-5 = smd 0.55 x 1.2: 1 -0.95,-1.3; 2 0,-1.3; 3 0.95,-1.3; 4 0.95,1.3; 5 -0.95,1.3
UDFN-8 = smd 0.3 x 0.65: 1 -0.975,-1.375; 2 -0.325,-1.375; 3 0.325,-1.375; 4 0.975,-1.375; 5 0.975,1.375; 6 0.325,1.375; 7 -0.325,1.375; 8 -0.975,1.375 | smd 2.35 x 1.6: EP 0,0

### Placement (x,y rotation side)
3V3_LED  1.98,31.65 270 bottom
5V_LED  1.93,27.48 270 bottom
BYP  6.15,12.7 90 bottom
C2  12.74,24.28 180 top
C3  7.44,58.57 270 top
C4  13.08,60.96 0 top
C5  12.74,22.61 180 top
C8  12.7,20.83 180 top
C9  9.65,37.08 180 top
C10  9.65,35.56 180 top
C11  9.65,38.61 180 top
C12  24.23,18.31 90 top
D1  9.4,29.72 90 top
D3  1.91,31.24 270 top
D4  1.91,35.05 270 top
D5  13.64,18.01 270 top
D8  1.91,27.43 270 top
F2  7.75,12.78 90 top
FD1  83.57,68.33 0 bottom
FD2  83.57,68.33 0 top
FD3  2.67,7.75 90 top
FD4  2.67,7.75 270 bottom
FRAME1  16.51,-25.4 0 top  (outside the outline)
H1  STAND-OFFTIGHT  [STAND-OFF-TIGHT]  2.54,22.86 0 top
H3  81.28,21.01 270 top
H4  43.18,20.98 270 top
H8  24.97,27.25 270 top
H14  2.54,71.12 0 top
H15  83.82,71.12 0 top
H16  83.82,2.54 0 top
H17  2.54,2.54 0 top
J1  28.96,47.5 180 top
J2  38.1,11.43 0 top
J3  10.16,6.4 0 top
J4  38.1,5.08 0 top
J5  3.11,60.97 90 top
J6  62.23,63.25 180 top
J8  21.82,68.94 270 top
J10  25.4,4.93 0 top
J13  4.11,53.75 0 top
LOGO1  37.85,8.38 0 top
LOGO2  62.23,30.48 0 bottom
LOGO3  81.79,8.38 0 bottom
MEAS  12.01,33.76 180 top
Q1  10.67,18.16 90 top
R1  5.08,8.89 270 top
R2  14.22,8.89 270 top
R3  13.97,72.26 180 top
R4  7.11,72.26 0 top
R5  4.19,34.92 270 top
R6  8,18.16 270 top
R7  10.92,49.48 0 top
R8  4.32,27.43 270 top
R9  12.74,26.16 0 top
R10  10.92,51.1 180 top
R11  4.19,31.29 270 top
S1  4.19,49.91 180 top
S2  4.19,43.18 180 top
S3  10.54,68.58 180 top
TP1  2.54,55.88 0 bottom
TP2  6.22,55.88 0 bottom
TP3  16.51,66.04 0 bottom
TP4  3.68,13.08 0 bottom
U2  10.97,58.57 90 top
U5  12.85,29.95 180 top
U$1  [3V332530]  5.59,31.24 270 top
U$2  [VIN32529]  5.71,27.43 270 top
U$3  [CHG32528]  5.71,34.92 270 top
U$4  [FUNCTION_ZERO517]  62.61,71.37 0 top
U$5  [PROCESSOR522]  27.56,55.24 0 top
U$6  [#3V3_LED#17]  5.59,31.78 0 bottom
U$7  [#VIN_LED#16]  5.38,27.46 0 bottom
U$8  [#PTC#18]  8.53,12.78 0 bottom
U$9  [BOOT32541]  8.74,42.9 270 top
U$10  [RESET32540]  8.64,49.78 270 top
U$11  [#3V3_EN#18]  12.04,29.69 0 bottom
U$12  [MICROMOD_MI_LOGO_1]  18.03,61.98 0 top
U$13  [0525]  62.48,55.37 0 top
U$14  [MICROMOD_LOGO_1]  59.82,23.5 0 bottom
U$15  [MAIN523]  66.29,16.89 0 bottom
U$16  [BOARD524]  54.36,16.76 0 bottom
U$17  [100MA6]  7.49,68.45 270 top
U$18  [500MA101]  13.59,68.45 270 top
U$19  [MAIN_BOARD5523]  31.88,61.47 0 top
U$20  [QWIIC_3MM]  2.54,20.32 0 top
U$21  [STANDOFF501]  3.56,19.18 0 top
U$22  [SFE_LOGO_FLAME_.2]  2.75,13.54 0 top
VE  8.76,29.62 270 bottom

### Tracks (layer width: path | path; a pad name or v marks a point on that pad's centre or on a via)
3.3V  (via drill 0.3, 0.35)
  Top 0.203: J5.1 4.45,58.43 5.08,59.05 5.08,62.36 5.46,62.74 v7.37,62.74 | R11.2 6.57,30.44 9.88,33.76 MEAS.4
  Top 0.559: v49.02,68.58 22.76,68.58 16.84,62.66 v16.33,62.66 16.2,62.53 v16.2,43.69 | v38.1,29.72 37.62,29.25 J2.2 37.6,12.18 37.6,9.88 | v10.67,41.91 10.67,38.77 C11.1 | C12.1 24.35,17.35 J10.4 24.41,15.37 24.41,11.88 26.42,9.88 37.6,9.88 | J4.2 37.6,9.88
  Bottom 0.203: v16.33,62.66 16.26,62.74 v7.37,62.74 | TP2.1 4.65,55.88 3.75,56.78 J5.1
  Bottom 0.559: v38.1,29.72 38.1,42.49 v38.1,43.69 v19.56,43.69 v16.2,43.69 12.45,43.69 v10.67,41.91 | v49.02,68.58 69.85,68.58 70.81,67.61 v70.81,67.03
  pour Top (isolate 0.305, no thermals): 9.88,32.87 9.88,39.68 11.76,39.68 11.76,32.87
  pour Top (isolate 0.305, no thermals): 37.85,45.92 37.85,43.21 38.84,43.21 38.84,43.89 38.28,44.45 38.28,45.92
  pour Top (isolate 0.305, no thermals): 20.07,45.97 19.56,45.97 19.56,44.45 19.3,44.2 19.3,43.18 20.07,43.18
  pour Top (no thermals): 70.84,68.55 71.12,68.55 71.12,66.75 70.61,66.75 70.61,67.51 70.84,67.51
3.3V_EN  (via drill 0.3)
  Top 0.203: J1.4 20.46,42.55 19.3,41.4 19.3,34.54 18.92,34.16 v18.8,34.16
  Bottom 0.203: v18.8,34.16 17.14,32.51 12.7,32.51 10.21,30.02 VE.1
3.3V_EN_VE  (via drill 0.3)
  Top 0.203: U5.5 11.9,28.54 11.9,27.94 11.89,27.94 | R9.1 11.89,27.94 | 11.89,27.94 11.15,27.94 10.52,28.57 D1.C 9.4,28.96 9.65,29.21 v10.41,29.21
  Bottom 0.203: VE.2 v10.41,29.21
!BOOT!  (via drill 0.3)
  Top 0.203: S2.4 S2.3 8.26,45.09 v8.38,45.21 | J1.11 22.23,52.75 22.23,50.34 v21.97,50.09
  Bottom 0.203: v8.38,45.21 12.17,49 20.88,49 v21.97,50.09
!CS0!-PROCESSOR  (via drill 0.3)
  Top 0.203: J1.55 33.21,54.54 33.53,54.86 68.25,54.86 72.14,58.75 72.14,61.34 71.3,62.18 66.04,62.18 65,63.22 65,64.2 65.02,64.23 v65.02,65.02 | v65.02,66.55 64.97,66.6 J6.49
  Bottom 0.203: v65.02,66.55 65,66.52 65,65.05 v65.02,65.02
!RESET!  (via drill 0.3)
  Top 0.203: 4.06,51.82 S1.4 1.02,51.82 0.51,52.32 0.51,62.17 1.84,63.51 J5.10 | 4.06,51.82 S1.3 7.37,51.82 7.11,51.56 v7.11,49.53 | J13.1 4.12,51.87 4.06,51.82 | v18.14,49.53 19.81,49.53 20.96,48.39 J1.6
  Bottom 0.203: v18.14,49.53 v7.11,49.53
A0-PROCESSOR
  Top 0.203: J1.34 27.96,43.89 28.46,43.39 28.46,38.67 31.45,35.68 59.51,35.68 77.93,54.1 77.93,63.3 75.59,65.63 64.36,65.63 62.23,63.5 J6.38
CTS1-PROCESSOR  (via drill 0.3)
  Top 0.203: J1.15 23.21,58.48 v23.11,58.57 | v28.47,58.6 56.06,58.6 56.72,59.26 56.72,60.96 J6.16
  Bottom 0.203: v23.11,58.57 23.14,58.6 v28.47,58.6
D0-PROCESSOR  (via drill 0.3)
  Top 0.203: J1.10 v21.96,42.68 v21.95,42.67 | v64.47,67.16 64.48,67.17 J6.47 | v37.34,42.67 37.34,41.76 37.67,41.43 55.7,41.43 72.92,58.65 72.92,61.04 71.32,62.64 66.14,62.64 65.56,63.22 v65.56,64.21
  Bottom 0.203: v64.47,67.16 64.47,64.49 64.75,64.21 v65.56,64.21 | v21.95,42.67 v37.34,42.67
D1-PROCESSOR/SD_CARD_!CS!  (via drill 0.3)
  Top 0.203: v27.05,37.26 27.05,37.21 21.69,31.85 21.69,24.15 26.55,19.29 J10.2 | v24.38,40.13 23.96,40.56 J1.18
  Bottom 0.203: v27.05,37.26 27.05,37.47 v24.38,40.13
D+
  Top 0.203: J1.3 20.21,51.02 22.1,49.12 24.02,49.12 25.83,47.32 25.83,39.8 19.13,33.1 19.13,17.39 18.77,17.04 17.5,17.04 16.49,16.02 16.49,14.75 15.38,13.64 11.28,9.55 10.91,9.17 10.91,7.62 | J3.B6 10.91,7.62 | J3.A6 9.91,7.37 10.16,7.62 10.91,7.62
D-  (via drill 0.3)
  Top 0.203: v20.73,49.76 20.83,49.76 21.82,48.77 23.88,48.77 25.5,47.14 25.5,39.98 18.8,33.27 18.8,17.53 18.64,17.36 17.36,17.36 16.14,16.14 16.14,14.87 9.41,8.14 J3.B7 9.41,5.17 9.65,4.93 10.16,4.93 10.41,5.18 J3.A7 | v21.46,50.57 20.73,51.31 20.73,52.75 J1.5
  Bottom 0.203: v21.46,50.57 20.73,49.84 v20.73,49.76
G0-PROCESSOR  (via drill 0.3)
  Top 0.203: J1.40 29.46,39.09 32.22,36.33 58.66,36.33 77.29,54.95 77.29,63.17 75.18,65.28 67.77,65.28 67.51,65.02 v67.31,65.02 | v67.06,66.52 66.95,66.62 66.19,66.62 65.95,66.86 65.95,68.5 J6.53
  Bottom 0.203: v67.06,66.52 67.06,65.28 v67.31,65.02
G1-PROCESSOR  (via drill 0.3)
  Top 0.203: J1.42 29.96,39.8 32.63,37.13 57.95,37.13 76.43,55.61 76.43,63.2 74.68,64.95 68.05,64.95 67.59,64.49 v66.8,64.49 | v66.55,67.13 66.48,67.13 J6.55
  Bottom 0.203: v66.55,67.13 66.55,64.75 v66.8,64.49
G2-PROCESSOR  (via drill 0.3)
  Top 0.203: J1.44 30.46,40.52 33.06,37.91 57.23,37.91 75.68,56.35 75.68,63.13 74.3,64.52 68.33,64.52 v67.82,64.01 | J6.57 66.98,67.56 67.82,66.73 v67.82,66.55
  Bottom 0.203: v67.82,64.01 v67.82,66.55
G3-PROCESSOR  (via drill 0.3)
  Top 0.203: J1.46 30.96,40.98 33.04,38.9 56.75,38.9 74.75,56.9 74.75,63.02 v74.88,63.14 | v77.5,65.73 77.5,68.38 75.29,70.59 68.56,70.59 67.48,69.51 J6.59
  Bottom 0.203: v77.5,65.73 77.47,65.73 v74.88,63.14
G4-PROCESSOR  (via drill 0.3)
  Top 0.203: J1.48 31.46,41.7 33.53,39.62 33.78,39.62 56.16,39.62 74.13,57.59 74.13,61.25 v73.91,61.47 | v68.33,67.03 67.98,67.38 J6.61
  Bottom 0.203: v73.91,61.47 69.85,61.47 68.33,62.99 v68.33,67.03
GND  (via drill 0.3)
  Top 0.203: v71.55,67.16 71.48,67.23 J6.75 71.48,69.24 71.8,69.56 | J3.GND2 13.38,6.83 v13.18,7.04 | J3.GND 6.53,6.47 v6.53,7.26
  Top 0.254: J6.36 61.75,60.99 61.75,62.13 61.29,62.59 v61.29,62.74 61.23,62.68 61.23,62.66 | J6.34 61.23,62.66 | J6.32 60.73,62.16 61.23,62.66
  other vias: 11.02,32.03 7.47,56.54 12.01,54.97 13.46,58.55 11.79,13.23 4.24,11.07 7.19,38.91 7.19,37.13 7.19,35.36 10.57,25.12 10.57,23.32 10.54,21.26 9.25,60.6 14.96,70.26 22.72,20.45 22.05,17.25 22.06,13.61 22.94,60.3 21.67,58.01 30.02,61.62 28.27,57.25 19.13,62.84 32.08,51.38 35.97,51.05 24.59,49.89 19.74,50.42 13.06,51.56 13.16,54.43 9.09,44.07 32.15,16.28 69.19,66.93 52.76,69.95 74.04,62.48 76.07,66.75 67.08,63.58 65.86,65.02 63.5,65.53 57.56,66.04 50.09,64.82 9.68,48.11 29.29,55.78 31.17,54.56 61.21,58.47 22.05,37.95 24.74,41.07 25.53,34.37 27.94,36.7 6.71,63.45 15.24,60.58 6.2,70.76 14.83,11.07 15.28,15.5 28.3,46.79 38.2,51.08 19.73,54.44
  pour Top (rank 4): 0,73.66 86.36,73.66 86.36,0 0,0
  pour Bottom (rank 4): 0,0 0,73.66 86.36,73.66 86.36,0
HOST_D+
  Top 0.203: J6.35 61.48,66.78 58.97,64.27 58.97,58.94 57.25,57.22 29.33,57.22 28.21,56.09 J1.35
HOST_D-
  Top 0.203: J6.37 61.98,66.81 59.3,64.13 59.3,58.79 57.39,56.88 29.47,56.88 28.71,56.12 J1.37
I2C_!INT!  (via drill 0.3)
  Top 0.203: J6.23 58.47,69.7 60.17,71.4 75.72,71.4 79.76,67.36 79.76,53.19 60.71,34.14 29.36,34.14 v27.15,36.35 | v23.88,39.62 23.46,40.04 J1.16
  Bottom 0.203: v27.15,36.35 v23.88,39.62
I2C_SCL  (via drill 0.3)
  Top 0.203: v26.9,35.56 29.39,33.07 38.71,33.07 39.65,32.13 39.65,12.44 39.6,12.39 39.6,12.23 J2.4 39.65,12.18 39.65,11.99 39.6,11.94 J4.4 | v24.13,47.24 22.96,46.07 J1.14 22.96,39.5 v23.27,39.19 | v25.58,48.62 25.58,48.77 25.93,49.12 25.93,63.96 29.18,67.21 50.14,67.21 v50.29,67.06 | v57.96,67 57.96,68.5 J6.21
  Bottom 0.203: v26.9,35.56 v23.27,39.19 | v50.29,67.06 51.05,67.06 51.31,66.8 57.76,66.8 v57.96,67 | v24.13,47.24 24.16,47.24 25.53,48.62 v25.58,48.62
I2C_SDA  (via drill 0.3)
  Top 0.203: v26.01,35.23 29.08,32.16 38.62,32.16 38.93,31.85 38.93,13.39 38.62,13.08 J2.3 38.6,12.18 J4.3 | v23.88,48.01 22.46,46.59 J1.12 22.46,38.86 v22.76,38.56 | v25.04,49.25 25.6,49.81 25.6,64.49 28.93,67.82 50.09,67.82 v50.09,67.79 | v57.33,67.31 57.48,67.46 J6.19
  Bottom 0.203: v26.01,35.23 22.76,38.48 v22.76,38.56 | v50.09,67.79 50.93,67.79 51.41,67.31 v57.33,67.31 | v23.88,48.01 23.88,48.06 25.04,49.23 v25.04,49.25
N$2
  pour Top (isolate 0.305, no thermals): 13.69,31.01 13.69,32.16 12.42,32.16 12.42,34.7 14.2,34.7 14.2,32.16 13.94,32.16 13.94,31.01
N$3
  Top 0.203: D3.A 1.93,32.14 R11.1
N$4
  Top 0.203: R2.2 13.12,8.04 12.7,7.62 12.27,7.19 11.91,6.83 J3.B5
N$5  (via drill 0.3)
  Top 0.203: v3.81,8.13 4.99,8.13 R1.2 | J3.A5 8.91,7.6 v8.64,7.87
  Bottom 0.203: v8.64,7.87 8.38,8.13 v3.81,8.13
N$6  (via drill 0.3)
  Top 0.305: J3.VBUS1 7.71,5.5 8.94,4.27 | J3.VBUS2 12.61,5.5 11.38,4.27
  Top 0.559: F2.1 7.8,11.22 7.71,11.14 J3.VBUS1 | 8.94,4.27 11.38,4.27
  Bottom 0.559: v7.8,12.19 7.7,12.29 BYP.1
  pour Top (isolate 0.305, no thermals): 6.35,10.9 8.92,10.9 8.92,11.66 8.26,11.66 8.26,12.55 7.37,12.55 7.37,11.66 6.35,11.66
N$7
  Top 0.178: S3.1 13.1,72.28 R3.2
N$8
  Top 0.203: U2.5 10.38,57.62 11.18,58.42 11.18,63.5 | 11.18,63.5 S3.4 | 11.18,63.5 10.29,63.5 9.91,63.88 S3.3
N$9  (via drill 0.3)
  Top 0.203: v3.1,27.41 2.76,27.41 D8.C
  Bottom 0.203: 5V_LED.2 2.95,26.96 3.1,27.11 v3.1,27.41
N$10  (via drill 0.3)
  Top 0.203: D3.C 2.78,31.24 v3.05,31.24
  Bottom 0.203: v3.05,31.24 2.93,31.13 3V3_LED.2
N$11
  Top 0.178: S3.2 7.98,72.28 R4.2
N$12
  Top 0.203: D8.A 4.29,28.31 R8.1
N$14
  Top 0.203: R5.2 2,34.08 D4.C
N$15  (via drill 0.3)
  Top 0.203: R5.1 4.19,43.31 5.33,44.45 v8.38,44.45 | U2.1 12.31,57.66 13.46,57.66 13.97,57.15 v13.97,48.26
  Bottom 0.203: v8.38,44.45 12.19,48.26 v13.97,48.26
PROCESSOR_CAN-RX
  Top 0.203: J1.41 29.71,55.33 30.7,56.33 58.01,56.33 59.85,58.17 59.85,63.35 62.99,66.49 62.99,66.5 63.48,66.98 J6.43
PROCESSOR_CAN-TX  (via drill 0.3)
  Top 0.203: J1.43 30.21,55.35 30.84,55.98 58.24,55.98 60.2,57.94 60.2,63.17 63.48,66.45 v63.67,66.45 | v62.97,67.26 62.98,67.27 J6.41
  Bottom 0.203: v63.67,66.45 62.97,67.15 v62.97,67.26
PWM0-PROCESSOR
  Top 0.203: J1.32 27.46,43.68 27.96,43.18 27.96,37.78 30.63,35.11 60.28,35.11 78.71,53.54 78.71,63.52 76.22,66.02 66.27,66.02 65.48,66.8 J6.51
PWR_EN0  (via drill 0.3)
  Top 0.203: v74.27,63.52 73.41,62.66 73.41,57.86 56.06,40.51 37.19,40.51 36.46,41.24 J1.68 36.46,46.73 35.94,47.24 29.46,47.24 28.96,46.74 J1.38 | v76.89,66.14 76.89,67.84 74.83,69.9 70.92,69.9 70.48,69.46 J6.71
  Bottom 0.203: v76.89,66.14 76.89,66.09 74.32,63.52 v74.27,63.52
RTS1-PROCESSOR  (via drill 0.3)
  Top 0.203: J1.13 22.71,53.94 22.61,54.04 v22.61,58.06 | J6.18 57.23,58.75 56.52,58.04 v28.02,58.04
  Bottom 0.203: v28.02,58.04 22.63,58.04 v22.61,58.06
RX1-PROCESSOR  (via drill 0.3)
  Top 0.203: v29,60 50.89,60 53.23,62.34 53.7,62.34 55.98,64.62 J6.13 | v24.2,60.13 v24.21,60.12 J1.19
  Bottom 0.203: v24.2,60.13 28.86,60.13 v29,60
SHLD
  pour Bottom (isolate 0.305, no thermals): 6.1,6.1 6.1,0 14.99,0 14.99,6.1
  pour Top (isolate 0.305, no thermals): 14.99,6.1 14.99,0 6.1,0 6.1,6.1
SPI_PROCESSOR_SCK  (via drill 0.3)
  Top 0.203: J1.57 33.71,51.59 33.22,51.11 | 33.22,51.11 32.91,50.8 27.69,50.8 27.3,51.18 27.3,61.53 31.22,65.44 53.14,65.44 53.48,65.78 J6.3 | v34.54,49.78 34.04,49.28 28.96,49.28 26.67,46.99 26.67,43.1 26.92,42.85 26.92,39.22 20.45,32.74 20.45,20.5 23.25,17.7 J10.5 | v32.77,51.56 33.22,51.11
  Bottom 0.203: v34.54,49.78 v32.77,51.56
SPI_PROCESSOR_SDI  (via drill 0.3)
  Top 0.203: J1.61 34.71,51.86 34.76,51.81 34.76,51.23 33.33,49.8 27.94,49.8 | 27.94,49.8 27.27,49.8 26.3,50.77 26.3,63.02 29.84,66.55 50.83,66.55 v50.86,66.52 | v50.88,64.92 53.78,64.92 54.5,65.64 54.5,68.5 J6.7 | 27.94,49.8 27.94,49.28 26.26,47.6 26.26,39.4 19.83,32.96 19.83,19.76 21.05,18.54 J10.7
  Bottom 0.203: v50.86,66.52 50.86,64.95 v50.88,64.92
SPI_PROCESSOR_SDO  (via drill 0.3)
  Top 0.203: J1.59 34.23,52.75 v34.23,51.56 34.23,51.41 33.12,50.3 27.48,50.3 26.8,50.97 26.8,62.2 30.61,66 52.91,66 v52.95,66.04 | J6.5 53.97,66.05 v53.99,66.03 | v35.31,51.56 35.31,49.28 34.73,48.7 29.27,48.7 27.05,46.48 27.05,43.36 27.41,43 27.41,38.86 21.13,32.59 21.13,23.78 25.45,19.47 J10.3
  Bottom 0.203: v52.95,66.04 v53.98,66.04 v53.99,66.03 | v35.31,51.56 v34.23,51.56
SWDCK  (via drill 0.3)
  Top 0.203: J1.21 24.71,60.89 24.13,61.47 v18.54,61.47 | v6.86,61.21 6.1,60.45 6.1,57.45 5.41,56.77 1.45,56.77 1.02,57.2 1.02,59.05 1.66,59.7 J5.4
  Bottom 0.203: v18.54,61.47 7.11,61.47 v6.86,61.21
SWDIO  (via drill 0.3)
  Top 0.203: J1.23 25.21,61.41 24.64,61.98 v19.05,61.98 | v6.6,61.98 5.97,61.98 5.59,61.59 5.59,57.78 5.08,57.28 2.79,57.28 2.48,57.59 J5.2
  Bottom 0.203: v19.05,61.98 v6.6,61.98 | TP1.1 2.48,55.94 J5.2
TX1-PROCESSOR  (via drill 0.3)
  Top 0.203: v23.7,60.7 23.68,60.7 23.68,52.8 J1.17 | v28.63,60.69 29.08,60.69 29.42,60.35 50.77,60.35 53.11,62.69 53.57,62.69 55.47,64.59 v55.47,66.13 | v56.5,66.15 56.48,66.17 J6.15
  Bottom 0.203: v23.7,60.7 v23.71,60.7 28.62,60.7 v28.63,60.69 | v55.47,66.13 56.48,66.13 v56.5,66.15
V_BATT  (via drill 0.35)
  Top 0.559: v17.78,66.04 17.78,67.6 J8.2 14.18,67.94 12.23,65.99 C4.1 12.23,59.56 U2.3 13.88,59.52 15.06,58.34 15.06,41.58 16.26,40.39 16.26,19.43 14.99,18.16 Q1.3
  Bottom 0.559: v17.78,66.04 TP3.1
VCC  (via drill 0.3)
  Top 0.203: D4.A 1.02,35.93 0.76,35.67 0.76,29.97 1.47,29.26 5.79,29.26 7.62,27.43 v10.92,27.43
  Top 0.559: U2.4 8.72,59.52 8.64,59.44 8.64,45.97 14.99,39.62 14.99,28.4 v13.99,27.41
  Bottom 0.203: v13.99,27.41 10.95,27.41 v10.92,27.43
  pour Top (isolate 0.305, no thermals): 13.69,28.85 13.69,27.84 12.93,27.84 12.93,19.68 11.2,19.68 11.2,18.75 14.4,18.75 14.4,28.85
  pour Top (isolate 0.305, no thermals): 10.31,59.16 10.31,59.79 9.04,59.79 8.79,60.05 6.88,60.05 6.88,58.9 8.79,58.9 9.04,59.16
VIN  (via drill 0.3, 0.35, 0.38)
  Top 0.203: R10.2 10.07,52.24 11.46,53.62 v12.98,53.62 | R8.2 4.32,25.76 5.74,24.33 5.74,17.58 6.58,16.74 | 7.85,15.47 7.4,15.91 6.58,16.74 | J1.9 21.71,56.53 20.83,57.4 v20.83,59.31 | 6.58,16.74 7.15,17.31 R6.2
  Top 0.559: v17.55,59.26 17.35,59.05 v17.35,53.59 17.35,19.13 15.08,16.86 D5.A 13.66,16.83 13.66,16.23 13.18,15.75 11.68,15.75 | 11.68,15.75 8.13,15.75 7.85,15.47 7.62,15.24 7.62,14.4 F2.2 | Q1.1 11.67,15.76 11.68,15.75
  Bottom 0.203: v12.98,53.62 17.32,53.62 v17.35,53.59
  Bottom 0.559: v17.55,59.26 17.6,59.31 v20.83,59.31 70.94,59.31 v70.97,59.33 | v7.77,13.36 7.52,13.11 BYP.2 3.71,13.11 TP4.1
  pour Top (no thermals): 70.61,61.72 70.87,61.72 70.87,59.94 71.12,59.94 71.12,61.72 71.37,61.72 71.37,59.94 71.53,59.94 71.53,58.78 70.36,58.78 70.36,59.94 70.61,59.94
  pour Top (isolate 0.305, no thermals): 6.35,14.71 6.35,13.69 7.37,13.69 7.37,13.11 8.13,13.11 8.13,13.69 9.14,13.69 9.14,14.71
VIN/3  (via drill 0.3)
  Top 0.203: J1.49 31.71,51.82 31.4,51.51 v27.99,51.51 | R7.2 11.77,50.27 | R10.1 11.77,50.27 | 11.77,50.27 12.68,50.27 v13.13,50.72
  Bottom 0.203: v27.99,51.51 19,51.51 18.21,50.72 v13.13,50.72

### Text on the board
Bottom: v10
tPlace: - | +
Measures: Units in Inches
tDocu: Elias Santistevan